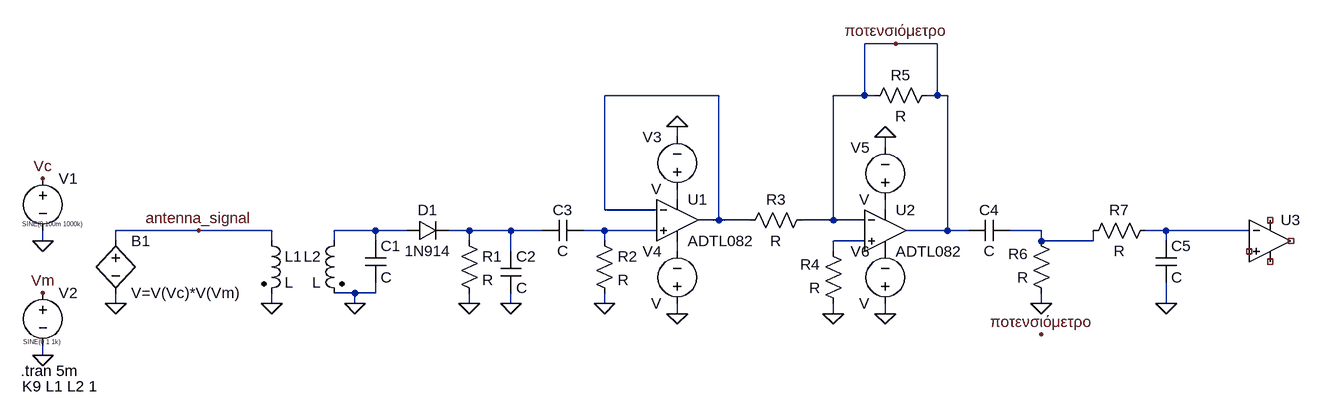
[diagram p0: schematic model in ltspice.asc]
model in ltspice.asc, the LTspice schematic file:
Version 4
SHEET 1 1764 680
WIRE 1136 -176 1088 -176
WIRE 1200 -176 1136 -176
WIRE 864 -96 688 -96
WIRE 1088 -96 1088 -176
WIRE 1088 -96 1040 -96
WIRE 1104 -96 1088 -96
WIRE 1200 -96 1200 -176
WIRE 1200 -96 1184 -96
WIRE 1216 -96 1200 -96
WIRE 800 -32 800 -48
WIRE 1120 -16 1120 -32
WIRE 800 64 800 48
WIRE 688 80 688 -96
WIRE 768 80 688 80
WIRE 1120 80 1120 64
WIRE 864 96 864 -96
WIRE 864 96 832 96
WIRE 912 96 864 96
WIRE 1040 96 1040 -96
WIRE 1040 96 992 96
WIRE 1088 96 1040 96
WIRE 64 112 -64 112
WIRE 176 112 64 112
WIRE 336 112 272 112
WIRE 384 112 336 112
WIRE 480 112 448 112
WIRE 544 112 480 112
WIRE 592 112 544 112
WIRE 688 112 656 112
WIRE 768 112 688 112
WIRE 1216 112 1216 -96
WIRE 1216 112 1152 112
WIRE 1248 112 1216 112
WIRE 1360 112 1312 112
WIRE 1552 112 1520 112
WIRE 1680 112 1552 112
WIRE -176 128 -176 112
WIRE -64 128 -64 112
WIRE 176 128 176 112
WIRE 272 128 272 112
WIRE 336 128 336 112
WIRE 480 128 480 112
WIRE 688 128 688 112
WIRE 1088 128 1040 128
WIRE 1360 128 1360 112
WIRE 1440 128 1440 112
WIRE 1440 128 1360 128
WIRE 1552 128 1552 112
WIRE 544 144 544 112
WIRE 800 144 800 128
WIRE 1040 144 1040 128
WIRE 304 208 272 208
WIRE 336 208 336 192
WIRE 336 208 304 208
WIRE -64 224 -64 208
WIRE 176 224 176 208
WIRE 304 224 304 208
WIRE 480 224 480 208
WIRE 544 224 544 208
WIRE 688 224 688 208
WIRE 1360 224 1360 208
WIRE 1552 224 1552 192
WIRE 800 240 800 224
WIRE 1040 240 1040 224
WIRE 1120 240 1120 224
WIRE -176 304 -176 288
FLAG -176 32 Vc
FLAG -176 208 Vm
FLAG -64 224 0
FLAG -176 304 0
FLAG -176 128 0
FLAG 64 112 antenna_signal
FLAG 176 224 0
FLAG 480 224 0
FLAG 544 224 0
FLAG 304 224 0
FLAG 688 224 0
FLAG 800 -48 0
FLAG 800 240 0
FLAG 1040 240 0
FLAG 1120 240 0
FLAG 1120 -32 0
FLAG 1360 224 0
FLAG 1136 -176 ποτενσιόμετρο
FLAG 1360 272 ποτενσιόμετρο
FLAG 1552 224 0
SYMBOL voltage -176 16 R0
WINDOW 3 -32 86 Left 0
WINDOW 123 0 0 Left 0
WINDOW 39 0 0 Left 0
SYMATTR InstName V1
SYMATTR Value SINE(0 100m 1000k)
SYMBOL voltage -176 192 R0
WINDOW 3 -30 91 Left 0
WINDOW 123 0 0 Left 0
WINDOW 39 0 0 Left 0
SYMATTR InstName V2
SYMATTR Value SINE(0 1 1k)
SYMBOL bv -64 112 R0
SYMATTR InstName B1
SYMATTR Value V=V(Vc)*V(Vm)
SYMBOL cap 320 128 R0
SYMATTR InstName C1
SYMBOL ind2 160 112 R0
SYMATTR InstName L1
SYMATTR Type ind
SYMBOL ind2 288 112 M0
SYMATTR InstName L2
SYMATTR Type ind
SYMBOL diode 384 128 R270
WINDOW 0 32 32 VTop 2
WINDOW 3 0 32 VBottom 2
SYMATTR InstName D1
SYMATTR Value 1N914
SYMBOL cap 528 144 R0
SYMATTR InstName C2
SYMBOL res 464 112 R0
SYMATTR InstName R1
SYMBOL cap 656 96 R90
WINDOW 0 0 32 VBottom 2
WINDOW 3 32 32 VTop 2
SYMATTR InstName C3
SYMBOL res 672 112 R0
SYMATTR InstName R2
SYMBOL res 1008 80 R90
WINDOW 0 0 56 VBottom 2
WINDOW 3 32 56 VTop 2
SYMATTR InstName R3
SYMBOL OpAmps\\ADTL082 800 32 R0
SYMATTR InstName U1
SYMBOL voltage 800 64 R180
WINDOW 0 24 96 Left 2
WINDOW 3 24 16 Left 2
SYMATTR InstName V3
SYMBOL voltage 800 240 R180
WINDOW 0 24 96 Left 2
WINDOW 3 24 16 Left 2
SYMATTR InstName V4
SYMBOL OpAmps\\ADTL082 1120 48 R0
SYMATTR InstName U2
SYMBOL voltage 1120 80 R180
WINDOW 0 24 96 Left 2
WINDOW 3 24 16 Left 2
SYMATTR InstName V5
SYMBOL voltage 1120 240 R180
WINDOW 0 24 96 Left 2
WINDOW 3 24 16 Left 2
SYMATTR InstName V6
SYMBOL res 1056 240 R180
WINDOW 0 36 76 Left 2
WINDOW 3 36 40 Left 2
SYMATTR InstName R4
SYMBOL res 1200 -112 R90
WINDOW 0 0 56 VBottom 2
WINDOW 3 32 56 VTop 2
SYMATTR InstName R5
SYMBOL cap 1312 96 R90
WINDOW 0 0 32 VBottom 2
WINDOW 3 32 32 VTop 2
SYMATTR InstName C4
SYMBOL res 1376 224 R180
WINDOW 0 36 76 Left 2
WINDOW 3 36 40 Left 2
SYMATTR InstName R6
SYMBOL res 1536 96 R90
WINDOW 0 0 56 VBottom 2
WINDOW 3 32 56 VTop 2
SYMATTR InstName R7
SYMBOL cap 1536 128 R0
SYMATTR InstName C5
SYMBOL OpAmps\\UniversalOpamp2 1712 128 R0
SYMATTR InstName U3
TEXT -210 328 Left 2 !.tran 5m
TEXT -208 352 Left 2 !K9 L1 L2 1

The netlist it stands for:
* model in ltspice.asc
V1 Vc 0 SINE(0 100m 1000k)
V2 Vm 0 SINE(0 1 1k)
B1 antenna_signal 0 V=V(Vc)*V(Vm)
C1 N004 0 C
L1 antenna_signal 0 L
L2 N004 0 L
D1 N004 N005 1N914
C2 N005 0 C
R1 N005 0 R
C3 N006 N005 C
R2 N006 0 R
R3 ποτενσιόμετρο N001 R
XU1 N006 N001 N002 N010 N001 ADTL082  ; pins In+ In- V+ V- OUT
V3 N002 0 V
V4 0 N010 V
XU2 N009 ποτενσιόμετρο N003 P001 ποτενσιόμετρο ADTL082  ; pins In+ In- V+ V- OUT
V5 N003 0 V
V6 0 P001 V
R4 0 N009 R
R5 ποτενσιόμετρο ποτενσιόμετρο R
C4 N007 ποτενσιόμετρο C
R6 0 N007 R
R7 N008 N007 R
C5 N008 0 C
XU3 NC_01 N008 NC_02 NC_03 NC_04 level.2 Avol=1Meg GBW=10Meg Slew=10Meg ilimit=25m rail=0 Vos=0 phimargin=45 en=0 enk=0 in=0 ink=0 Rin=500Meg  ; pins IN+ IN- V+ V- OUT
.model D D
.lib standard.dio
.tran 5m
K9 L1 L2 1
.lib ADI.lib
.lib UniversalOpamps2.sub
.backanno
.end